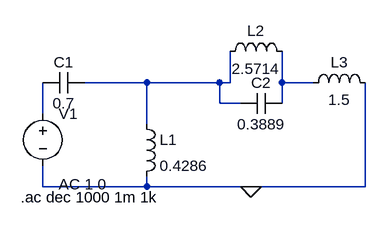
[diagram p0: schematic ej1_d.asc]
ej1_d.asc, the LTspice schematic file:
Version 4
SHEET 1 880 680
WIRE 208 80 112 80
WIRE 320 80 208 80
WIRE 336 80 336 32
WIRE 336 80 320 80
WIRE 416 80 416 32
WIRE 464 80 416 80
WIRE 320 112 320 80
WIRE 352 112 320 112
WIRE 416 112 416 80
WIRE 48 128 48 80
WIRE 208 144 208 80
WIRE 48 240 48 208
WIRE 208 240 208 224
WIRE 208 240 48 240
WIRE 368 240 208 240
WIRE 544 240 544 80
WIRE 544 240 368 240
FLAG 368 240 0
SYMBOL cap 112 64 R90
WINDOW 0 0 32 VBottom 2
WINDOW 3 32 32 VTop 2
SYMATTR InstName C1
SYMATTR Value 0.7
SYMBOL cap 416 96 R90
WINDOW 0 0 32 VBottom 2
WINDOW 3 32 32 VTop 2
SYMATTR InstName C2
SYMATTR Value 0.3889
SYMBOL ind 192 128 R0
SYMATTR InstName L1
SYMATTR Value 0.4286
SYMBOL ind 320 48 R270
WINDOW 0 32 56 VTop 2
WINDOW 3 5 56 VBottom 2
SYMATTR InstName L2
SYMATTR Value 2.5714
SYMBOL ind 448 96 R270
WINDOW 0 32 56 VTop 2
WINDOW 3 5 56 VBottom 2
SYMATTR InstName L3
SYMATTR Value 1.5
SYMBOL voltage 48 112 R0
WINDOW 123 24 124 Left 2
WINDOW 39 0 0 Left 0
SYMATTR InstName V1
SYMATTR Value ""
SYMATTR Value2 AC 1 0
TEXT 14 256 Left 2 !.ac dec 1000 1m 1k

The netlist it stands for:
* ej1_d.asc
C1 N001 N003 0.7
C2 N002 N001 0.3889
L1 N001 0 0.4286
L2 N001 N002 2.5714
L3 N002 0 1.5
V1 N003 0 AC 1 0
.ac dec 1000 1m 1k
.backanno
.end